# Altium schematic sheet DSP28335.SchDoc
size A3
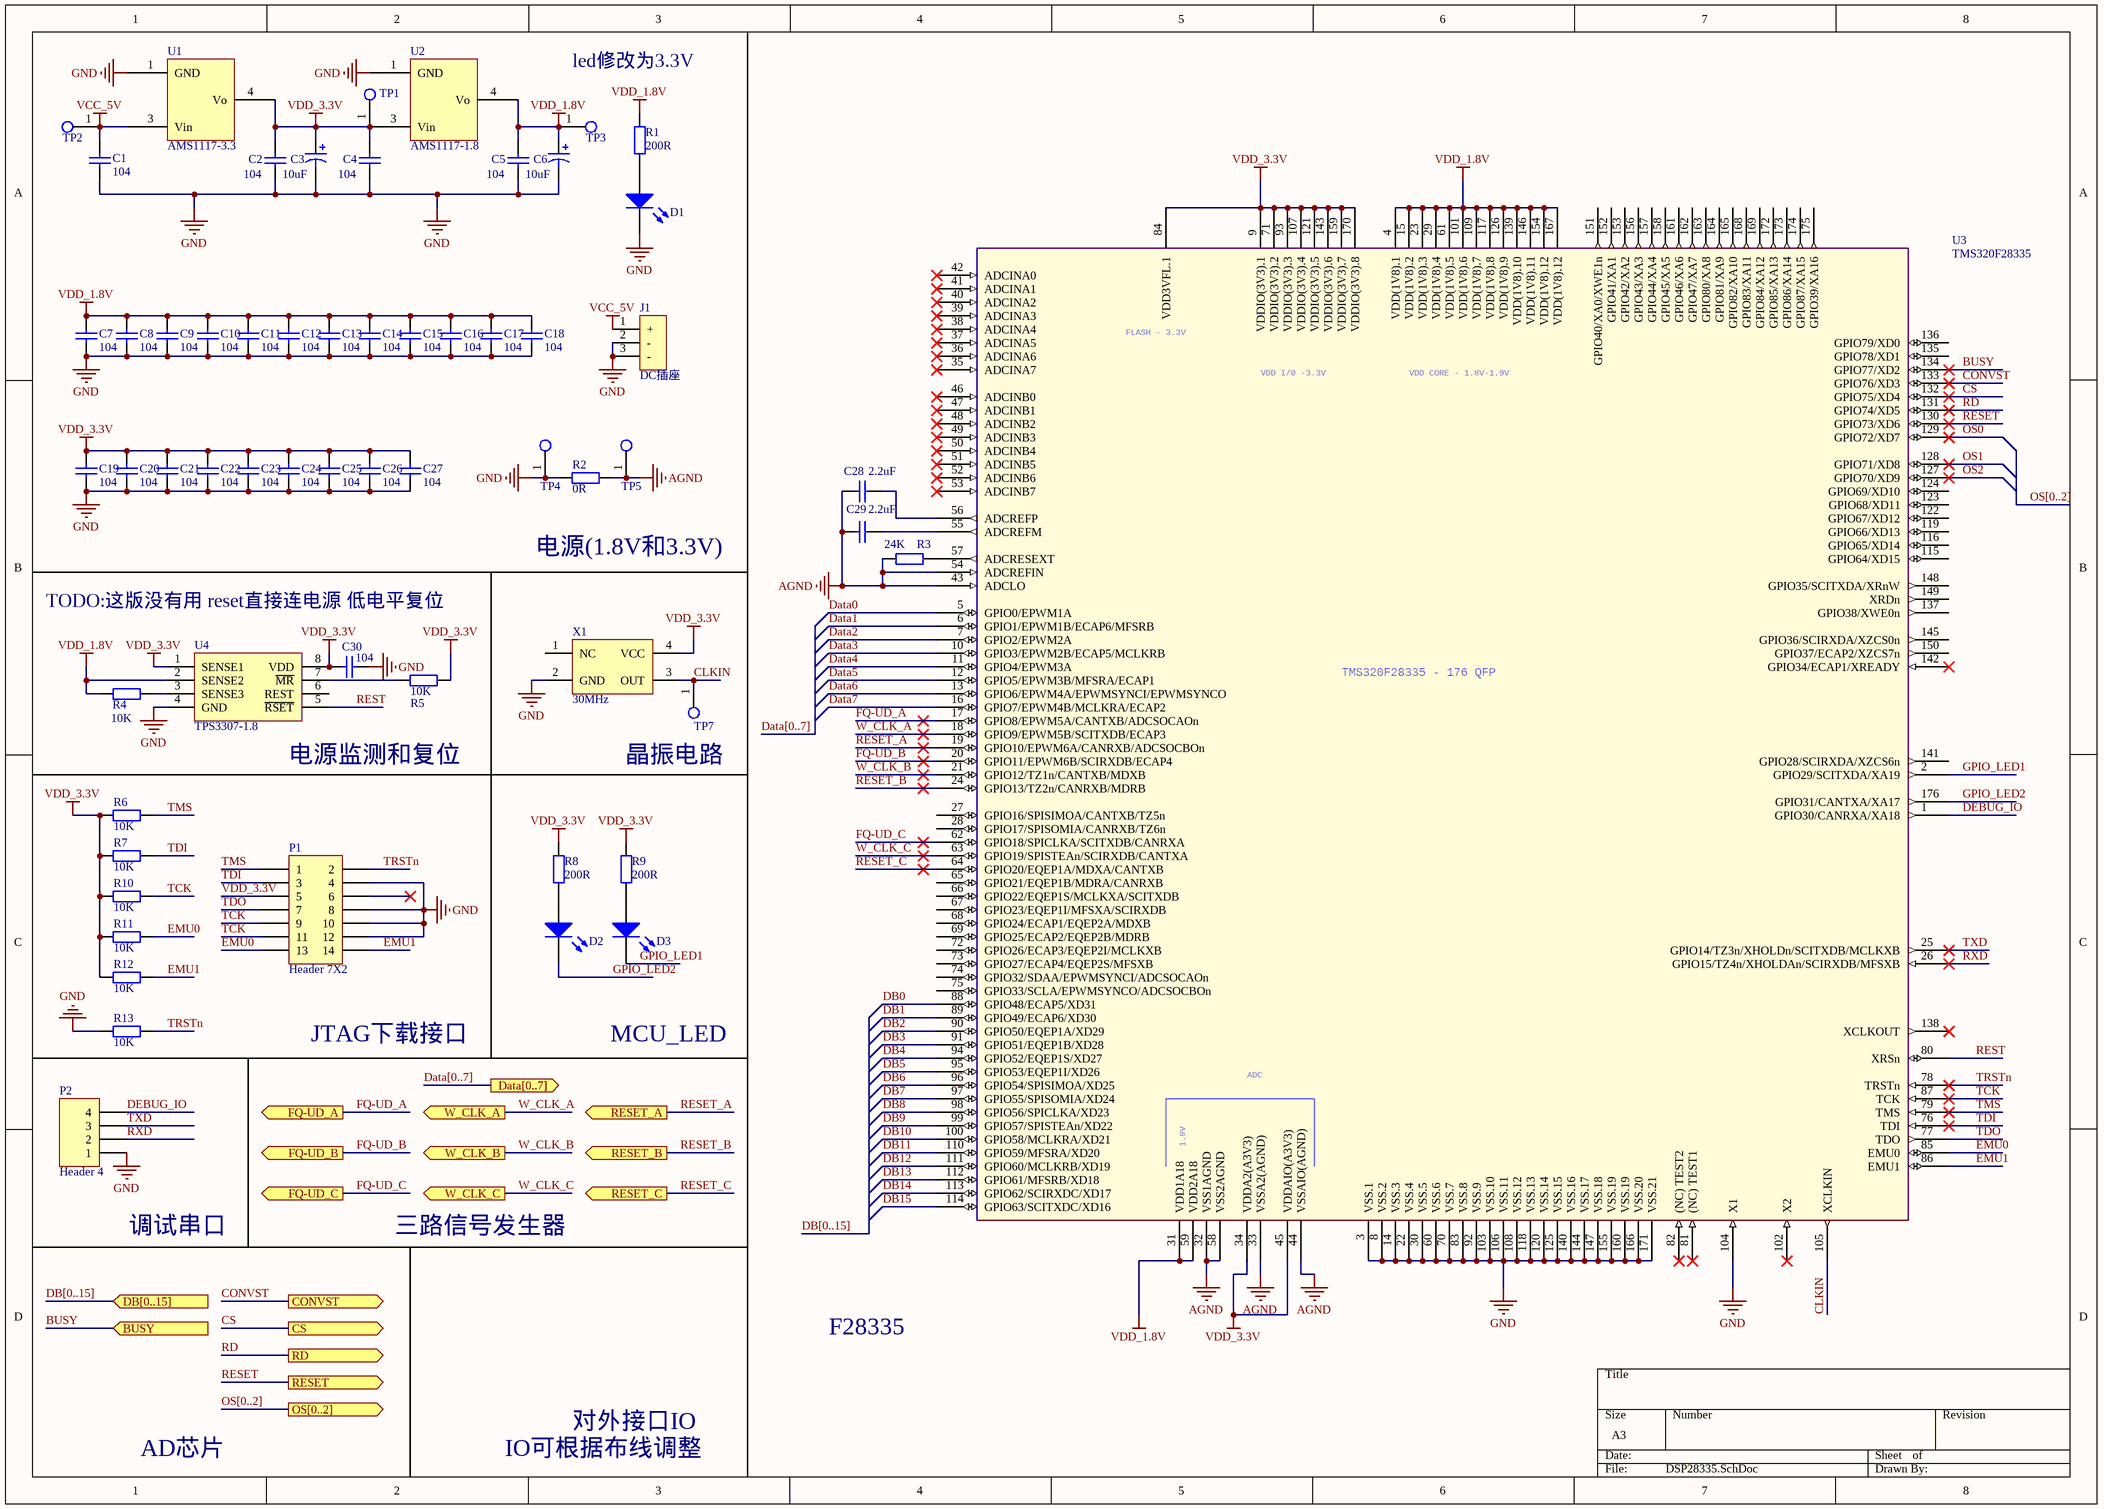
[diagram p0: DSP28335.SchDoc]

## Parts
C1  value 104  [0603]  (hidden comment: Cap)
C2  value 104  [0603]  (hidden comment: Cap)
C3  value 10uF  [Cap 3528B]  (hidden comment: Cap Poll)
C4  value 104  [0603]  (hidden comment: Cap)
C5  value 104  [0603]  (hidden comment: Cap)
C6  value 10uF  [Cap 3528B]  (hidden comment: Cap Poll)
C7  value 104  [0603]  (hidden comment: Cap)
C8  value 104  [0603]  (hidden comment: Cap)
C9  value 104  [0603]  (hidden comment: Cap)
C10  value 104  [0603]  (hidden comment: Cap)
C11  value 104  [0603]  (hidden comment: Cap)
C12  value 104  [0603]  (hidden comment: Cap)
C13  value 104  [0603]  (hidden comment: Cap)
C14  value 104  [0603]  (hidden comment: Cap)
C15  value 104  [0603]  (hidden comment: Cap)
C16  value 104  [0603]  (hidden comment: Cap)
C17  value 104  [0603]  (hidden comment: Cap)
C18  value 104  [0603]  (hidden comment: Cap)
C19  value 104  [0603]  (hidden comment: Cap)
C20  value 104  [0603]  (hidden comment: Cap)
C21  value 104  [0603]  (hidden comment: Cap)
C22  value 104  [0603]  (hidden comment: Cap)
C23  value 104  [0603]  (hidden comment: Cap)
C24  value 104  [0603]  (hidden comment: Cap)
C25  value 104  [0603]  (hidden comment: Cap)
C26  value 104  [0603]  (hidden comment: Cap)
C27  value 104  [0603]  (hidden comment: Cap)
C28  value 2.2uF  [0603]  (hidden comment: Cap)
C29  value 2.2uF  [0603]  (hidden comment: Cap)
C30  value 104  [0603]  (hidden comment: Cap)
D1  LED  [LED0603]  (value not drawn)
D2  LED  [LED0603]  (value not drawn)
D3  LED  [LED0603]  (value not drawn)
J1  DC插座  [DC插座 5.5mm*2.1mm]
P1  Header 7X2  [HDR2X7]
P2  Header 4  [HDR1X4]
R1  value 200R  [0603]  (hidden comment: Res)
R2  value 0R  [0603]  (hidden comment: Res)
R3  value 24K  [0603]  (hidden comment: Res)
R4  value 10K  [0603]  (hidden comment: Res)
R5  value 10K  [0603]  (hidden comment: Res)
R6  value 10K  [0603]  (hidden comment: Res)
R7  value 10K  [0603]  (hidden comment: Res)
R8  value 200R  [0603]  (hidden comment: Res)
R9  value 200R  [0603]  (hidden comment: Res)
R10  value 10K  [0603]  (hidden comment: Res)
R11  value 10K  [0603]  (hidden comment: Res)
R12  value 10K  [0603]  (hidden comment: Res)
R13  value 10K  [0603]  (hidden comment: Res)
TP1  testPoint  [TP_H]  (value not drawn)
TP2  testPoint  [TP_H]  (value not drawn)
TP3  testPoint  [TP_H]  (value not drawn)
TP4  testPoint  [TP_H]  (value not drawn)
TP5  testPoint  [TP_H]  (value not drawn)
TP7  testPoint  [TP_H]  (value not drawn)
U1  AMS1117-3.3  [TO-252-2L]
U2  AMS1117-1.8  [TO-252-2L]
U3  TMS320F28335  [TMS320F28335]
U4  TPS3307-1.8  [SOP-8]
X1  30MHz  [3225]

## Ports
BUSY (in), CONVST (out), CS (out), Data[0..7] (out), DB[0..15] (in), FQ-UD_A (out), FQ-UD_B (out), FQ-UD_C (out), OS[0..2] (out), RD (out), RESET (out), RESET_A (out), RESET_B (out), RESET_C (out), W_CLK_A (out), W_CLK_B (out), W_CLK_C (out)

## Nets
AGND: C28.2 C29.2 R2.1 R3.1 TP5.1 U3.32(VSS1AGND) U3.33(VSSA2(AGND)) U3.43(ADCLO) U3.44(VSSAIO(AGND)) U3.54(ADCREFIN) U3.58(VSS2AGND)
GND: C1.1 C2.1 C3.2 C4.1 C5.1 C6.2 C7.1 C8.1 C9.1 C10.1 C11.1 C12.1 C13.1 C14.1 C15.1 C16.1 C17.1 C18.1 C19.1 C20.1 C21.1 C22.1 C23.1 C24.1 C25.1 C26.1 C27.1 C30.1 D1.2(K) J1.2(-) J1.3(-) P1.4 P1.8 P1.10 P1.12 P2.1 R2.2 R13.1 TP4.1 U1.1(GND) U2.1(GND) U3.3(VSS.1) U3.8(VSS.2) U3.14(VSS.3) U3.22(VSS.4) U3.30(VSS.5) U3.60(VSS.6) U3.70(VSS.7) U3.83(VSS.8) U3.92(VSS.9) U3.103(VSS.10) U3.104(X1) U3.106(VSS.11) U3.108(VSS.12) U3.118(VSS.13) U3.120(VSS.14) U3.125(VSS.15) U3.140(VSS.16) U3.144(VSS.17) U3.147(VSS.18) U3.155(VSS.19) U3.160(VSS.19) U3.166(VSS.20) U3.171(VSS.21) U4.4(GND) X1.2(GND)
VCC_5V: C1.2 J1.1(+) TP2.1 U1.3(Vin)
VDD_1.8V: C5.2 C6.1 C7.2 C8.2 C9.2 C10.2 C11.2 C12.2 C13.2 C14.2 C15.2 C16.2 C17.2 C18.2 R1.2 R4.2 TP3.1 U2.4(Vo) U3.4(VDD(1V8).1) U3.15(VDD(1V8).2) U3.23(VDD(1V8).3) U3.29(VDD(1V8).4) U3.31(VDD1A18) U3.59(VDD2A18) U3.61(VDD(1V8).5) U3.101(VDD(1V8).6) U3.109(VDD(1V8).7) U3.117(VDD(1V8).8) U3.126(VDD(1V8).9) U3.139(VDD(1V8).10) U3.146(VDD(1V8).11) U3.154(VDD(1V8).12) U3.167(VDD(1V8).12) U4.2(SENSE2)
VDD_3.3V: C2.2 C3.1 C4.2 C19.2 C20.2 C21.2 C22.2 C23.2 C24.2 C25.2 C26.2 C27.2 C30.2 P1.5 R5.2 R6.1 R7.1 R8.1 R9.1 R10.1 R11.1 R12.1 TP1.1 U1.4(Vo) U2.3(Vin) U3.9(VDDIO(3V3).1) U3.34(VDDA2(A3V3)) U3.45(VDDAIO(A3V3)) U3.71(VDDIO(3V3).2) U3.84(VDD3VFL.1) U3.93(VDDIO(3V3).3) U3.107(VDDIO(3V3).4) U3.121(VDDIO(3V3).5) U3.143(VDDIO(3V3).6) U3.159(VDDIO(3V3).7) U3.170(VDDIO(3V3).8) U4.1(SENSE1) U4.8(VDD) X1.4(VCC)
BUSY: U3.134(GPIO77/XD2) ; port BUSY
CLKIN: TP7.1 U3.105(XCLKIN) X1.3(OUT)
CONVST: U3.133(GPIO76/XD3) ; port CONVST
CS: U3.132(GPIO75/XD4) ; port CS
Data0: U3.5(GPIO0/EPWM1A)
Data1: U3.6(GPIO1/EPWM1B/ECAP6/MFSRB)
Data2: U3.7(GPIO2/EPWM2A)
Data3: U3.10(GPIO3/EPWM2B/ECAP5/MCLKRB)
Data4: U3.11(GPIO4/EPWM3A)
Data5: U3.12(GPIO5/EPWM3B/MFSRA/ECAP1)
Data6: U3.13(GPIO6/EPWM4A/EPWMSYNCI/EPWMSYNCO)
Data7: U3.16(GPIO7/EPWM4B/MCLKRA/ECAP2)
DB0: U3.88(GPIO48/ECAP5/XD31)
DB1: U3.89(GPIO49/ECAP6/XD30)
DB2: U3.90(GPIO50/EQEP1A/XD29)
DB3: U3.91(GPIO51/EQEP1B/XD28)
DB4: U3.94(GPIO52/EQEP1S/XD27)
DB5: U3.95(GPIO53/EQEP1I/XD26)
DB6: U3.96(GPIO54/SPISIMOA/XD25)
DB7: U3.97(GPIO55/SPISOMIA/XD24)
DB8: U3.98(GPIO56/SPICLKA/XD23)
DB9: U3.99(GPIO57/SPISTEAn/XD22)
DB10: U3.100(GPIO58/MCLKRA/XD21)
DB11: U3.110(GPIO59/MFSRA/XD20)
DB12: U3.111(GPIO60/MCLKRB/XD19)
DB13: U3.112(GPIO61/MFSRB/XD18)
DB14: U3.113(GPIO62/SCIRXDC/XD17)
DB15: U3.114(GPIO63/SCITXDC/XD16)
DEBUG_IO: P2.4 U3.1(GPIO30/CANRXA/XA18)
EMU0: P1.13 R11.2 U3.85(EMU0)
EMU1: P1.14 R12.2 U3.86(EMU1)
FQ-UD_A: U3.17(GPIO8/EPWM5A/CANTXB/ADCSOCAOn) ; port FQ-UD_A
FQ-UD_B: U3.20(GPIO11/EPWM6B/SCIRXDB/ECAP4) ; port FQ-UD_B
FQ-UD_C: U3.62(GPIO18/SPICLKA/SCITXDB/CANRXA) ; port FQ-UD_C
GPIO_LED1: D3.2(K) U3.2(GPIO29/SCITXDA/XA19)
GPIO_LED2: D2.2(K) U3.176(GPIO31/CANTXA/XA17)
OS0: U3.129(GPIO72/XD7)
OS1: U3.128(GPIO71/XD8)
OS2: U3.127(GPIO70/XD9)
RD: U3.131(GPIO74/XD5) ; port RD
RESET: U3.130(GPIO73/XD6) ; port RESET
RESET_A: U3.19(GPIO10/EPWM6A/CANRXB/ADCSOCBOn) ; port RESET_A
RESET_B: U3.24(GPIO13/TZ2n/CANRXB/MDRB) ; port RESET_B
RESET_C: U3.64(GPIO20/EQEP1A/MDXA/CANTXB) ; port RESET_C
REST: U3.80(XRSn) U4.5(~{RSET})
RXD: P2.2 U3.26(GPIO15/TZ4n/XHOLDAn/SCIRXDB/MFSXB)
TCK: P1.9 P1.11 R10.2 U3.87(TCK)
TDI: P1.3 R7.2 U3.76(TDI)
TDO: P1.7 U3.77(TDO)
TMS: P1.1 R6.2 U3.79(TMS)
TRSTn: P1.2 R13.2 U3.78(TRSTn)
TXD: P2.3 U3.25(GPIO14/TZ3n/XHOLDn/SCITXDB/MCLKXB)
W_CLK_A: U3.18(GPIO9/EPWM5B/SCITXDB/ECAP3) ; port W_CLK_A
W_CLK_B: U3.21(GPIO12/TZ1n/CANTXB/MDXB) ; port W_CLK_B
W_CLK_C: U3.63(GPIO19/SPISTEAn/SCIRXDB/CANTXA) ; port W_CLK_C
NetC28_1: C28.1 U3.56(ADCREFP)
NetC29_1: C29.1 U3.55(ADCREFM)
NetD1_1: D1.1(A) R1.1
NetD2_1: D2.1(A) R8.2
NetD3_1: D3.1(A) R9.2
NetR3_2: R3.2 U3.57(ADCRESEXT)
NetR4_1: R4.1 U4.3(SENSE3)
NetR5_1: R5.1 U4.7(~{MR})

Not connected (* = marked no-connect by the designer): P1 6*; U3 27(GPIO16/SPISIMOA/CANTXB/TZ5n) 28(GPIO17/SPISOMIA/CANRXB/TZ6n) 35(ADCINA7)* 36(ADCINA6)* 37(ADCINA5)* 38(ADCINA4)* 39(ADCINA3)* 40(ADCINA2)* 41(ADCINA1)* 42(ADCINA0)* 46(ADCINB0)* 47(ADCINB1)* 48(ADCINB2)* 49(ADCINB3)* 50(ADCINB4)* 51(ADCINB5)* 52(ADCINB6)* 53(ADCINB7)* 65(GPIO21/EQEP1B/MDRA/CANRXB) 66(GPIO22/EQEP1S/MCLKXA/SCITXDB) 67(GPIO23/EQEP1I/MFSXA/SCIRXDB) 68(GPIO24/ECAP1/EQEP2A/MDXB) 69(GPIO25/ECAP2/EQEP2B/MDRB) 72(GPIO26/ECAP3/EQEP2I/MCLKXB) 73(GPIO27/ECAP4/EQEP2S/MFSXB) 74(GPIO32/SDAA/EPWMSYNCI/ADCSOCAOn) 75(GPIO33/SCLA/EPWMSYNCO/ADCSOCBOn) 81((NC)_TEST1)* 82((NC)_TEST2)* 102(X2)* 115(GPIO64/XD15) 116(GPIO65/XD14) 119(GPIO66/XD13) 122(GPIO67/XD12) 123(GPIO68/XD11) 124(GPIO69/XD10) 135(GPIO78/XD1) 136(GPIO79/XD0) 137(GPIO38/XWE0n) 138(XCLKOUT)* 141(GPIO28/SCIRXDA/XZCS6n) 142(GPIO34/ECAP1/XREADY)* 145(GPIO36/SCIRXDA/XZCS0n) 148(GPIO35/SCITXDA/XRnW) 149(XRDn) 150(GPIO37/ECAP2/XZCS7n) 151(GPIO40/XA0/XWE1n) 152(GPIO41/XA1) 153(GPIO42/XA2) 156(GPIO43/XA3) 157(GPIO44/XA4) 158(GPIO45/XA5) 161(GPIO46/XA6) 162(GPIO47/XA7) 163(GPIO80/XA8) 164(GPIO81/XA9) 165(GPIO82/XA10) 168(GPIO83/XA11) 169(GPIO84/XA12) 172(GPIO85/XA13) 173(GPIO86/XA14) 174(GPIO87/XA15) 175(GPIO39/XA16); U4 6(REST); X1 1(NC)

## Buses and harness runs
bus Data[0..7]
bus Data[0..7] = port Data[0..7]
bus DB[0..15]
bus DB[0..15] = port DB[0..15]
bus OS[0..2]
bus OS[0..2] = port OS[0..2]

## Notes on the sheet
- led修改为3.3V
- 电源(1.8V和3.3V)
- TODO:这版没有用 reset直接连电源 低电平复位
- (near U4) 电源监测和复位
- 晶振电路
- JTAG下载接口
- MCU_LED
- 调试串口
- 三路信号发生器
- F28335
- AD芯片
- IO可根据布线调整
- 对外接口IO
- (in symbol TMS320F28335) FLASH - 3.3V; VDD I/0 -3.3V; VDD CORE - 1.8V-1.9V; TMS320F28335 - 176 QFP; ADC; 1.8V

## Library data of the parts
C1 C2 C4 C5 C7-C30 = Cap: 原理图绘制者: 刘永钦; 原理图何处使用过: 2014年飞思卡尔底板; 原理图审核人1: 徐鹏飞; 封装0805何处使用: 2015年航行器遥控器; 原理图审核人2: 朱觉文; 封装0603何处使用过: 在2401转接板上使用; Pressure Voltage: 16V; 原理图提供者: 刘永钦; 封装0805绘制者: 刘永钦; 封装0805提供者: 刘永钦; 封装0805审核人1: 徐鹏飞; 封装0805审核人2: 朱觉文; 封装0603绘制者: 刘永钦; 封装0603提供者: 刘永钦; 封装0603审核人1: 朱觉文; 封装0603审核人2: 徐鹏飞
C3 C6 = Cap Poll: 原理图绘制者: 刘永钦; 原理图何处使用过: 2014年飞思卡尔底板; 原理图审核人1: 徐鹏飞; 封装CAP 钽 7343 E何处使用: 2014年飞思卡尔驱动板; 封装cap贴片铝电解质470uF 16V绘制者: 李泽; 封装cap贴片铝电解质470uF 16V何处使用: 2015年飞思卡尔主板; 封装Cap 3528B绘制者: 陈汉诚; 封装Cap 3528B使用过: 2015年飞思卡尔驱动板; 封装Cap直插 10uF 50V: 10级718学长; 封装Cap直插 10uF 50V使用过: 2012年XS128学习板的主板; 封装Cap 3528B审核人2: 朱觉文; Pressure Voltage: 16V; 原理图提供者: 刘永钦; 封装CAP 钽 7343 E绘制者: 刘永钦; 封装CAP 钽 7343 E提供者: 刘永钦; 封装CAP 钽 7343 E审核人1: 徐鹏飞; 封装cap贴片铝电解质470uF 16V提供者: 刘永钦; 封装cap贴片铝电解质470uF 16V审核人1: 徐鹏飞; 封装Cap 3528B提供者: 刘永钦; 封装Cap 3528B审核人1: 徐鹏飞; 封装Cap直插 10uF 50V提供者: 刘永钦; 封装Cap直插 10uF 50V审核人1: 徐鹏飞; 封装Cap直插 10uF 50V审核人2: 朱觉文; 封装cap贴片铝电解质470uF 16V审核人2: 朱觉文; 封装CAP 钽 7343 E审核人2: 朱觉文; 原理图审核人2: 朱觉文
D1-D3 = LED: 原理图绘制者: 刘永钦; 原理图何处使用过: 2014年飞思卡尔底板; 原理图审核人1: 徐鹏飞; Color: 蓝色; 封装1210LED何处使用过: 2014年的一个小板子; 封装LED_3mm何处使用过: 2014年变频器面板; 封装LED_0805使用过: 2015年飞思卡尔底板; 原理图审核人2: 朱觉文; 封装LED0603何处使用过: 2401转接板; 原理图提供者: 刘永钦; 封装1210LED绘制者: 刘永钦; 封装1210LED提供者: 刘永钦; 封装1210LED审核人1: 徐鹏飞; 封装LED_3mm绘制者: 刘永钦; 封装LED_3mm提供者: 刘永钦; 封装LED_0805绘制者: 刘永钦; 封装LED_0805提供者: 刘永钦; 封装LED_0805审核人1: 徐鹏飞; 封装1210LED审核人2: 朱觉文; 封装LED_0805审核人2: 朱觉文; 封装LED_3mm审核者2: 朱觉文; 封装LED0603绘制者: 刘永钦; 封装LED0603审核人2: 朱觉文; 封装LED0603提供者: 刘永钦; 封装LED0603审核人1: 徐鹏飞
J1 = DC插座: 原理图审核人2: 朱觉文; 原理图提供者: 刘永钦; 原理图审核人1: 徐鹏飞; 原理图何处使用过: Arduino小车控制板; 原理图绘制者: 刘永钦; 封装DC插座 5.5mm*2.1mm绘制者: 刘永钦; 封装DC插座 5.5mm*2.1mm提供者: 刘永钦; 封装DC插座 5.5mm*2.1mm审核人1: 徐鹏飞; 封装DC插座 5.5mm*2.1mm何处使用过: Arduino小车控制板; 封装DC插座 5.5mm*2.1mm审核人2: 朱觉文
P1 = Header 7X2: Header, 7-Pin, Dual row; LatestRevisionDate: 17-Jul-2002; LatestRevisionNote: Re-released for DXP Platform.; Publisher: Altium Limited
P2 = Header 4: Header, 4-Pin; LatestRevisionDate: 17-Jul-2002; LatestRevisionNote: Re-released for DXP Platform.; Publisher: Altium Limited
R1-R13 = Res: 原理图绘制者: 刘永钦; 原理图何处使用过: 2014年飞思卡尔底板; 原理图审核人1: 徐鹏飞; 封装0805何处使用过: 2015年航行器遥控器; 原理图审核人2: 朱觉文; 封装2512-RESC6332X06N何处使用过: 在无刷直流电机驱动板上使用过; 封装0603何处使用过: 在2401转接板上使用; 原理图提供者: 刘永钦; 封装0805绘制者: 刘永钦; 封装0805提供者: 刘永钦; 封装0805审核人1: 徐鹏飞; 封装0805审核人2: 朱觉文; 封装0603提供者: 刘永钦; 封装0603审核人2: 朱觉文; 封装0603审核人1: 徐鹏飞; 封装2512-RESC6332X06N审核人2: 朱觉文; 封装2512-RESC6332X06N提供者: 刘永钦; 封装2512-RESC6332X06N审核人1: 徐鹏飞; 封装0603绘制者: 刘永钦; 封装2512-RESC6332X06N绘制者: 刘永钦
TP1-TP5 TP7 = TP
U1 U2 = AMS1117
X1 = Oscillator